# Altium schematic sheet Middle_Main.SchDoc
size A4
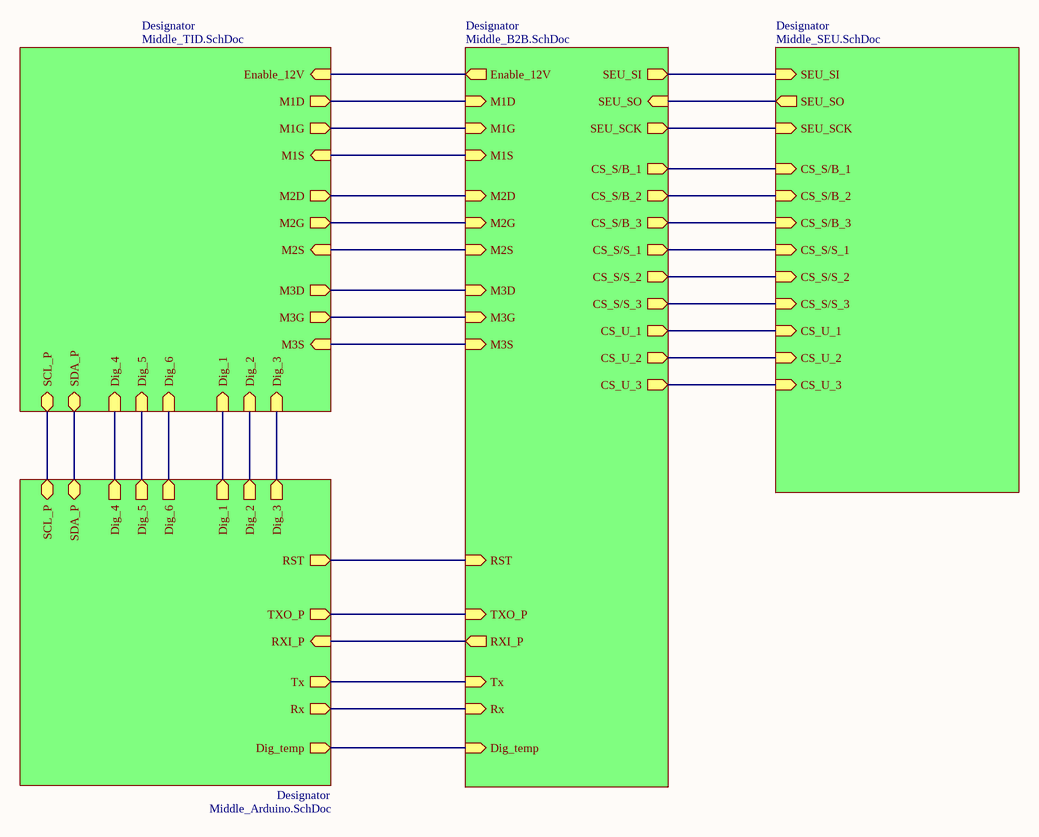
[diagram p0: Middle_Main.SchDoc]

## Sub-sheets
Designator = Middle_TID.SchDoc: M1D (out), M1G (out), M1S (in), M2D (out), M2G (out), M2S (in), M3D (out), M3G (out), M3S (in), Dig_1 (in), Dig_2 (in), Dig_3 (in), SCL_P (bidir), SDA_P (bidir), Enable_12V (in), Dig_4 (in), Dig_5 (in), Dig_6 (in)
Designator = Middle_SEU.SchDoc: SEU_SI (in), SEU_SO (out), SEU_SCK (in), CS_S/B_2 (in), CS_S/B_3 (in), CS_S/S_1 (in), CS_S/S_2 (in), CS_S/S_3 (in), CS_U_1 (in), CS_U_2 (in), CS_S/B_1 (in), CS_U_3 (in)
Designator = Middle_Arduino.SchDoc: SCL_P (bidir), SDA_P (bidir), Dig_1 (out), Dig_2 (out), Dig_3 (out), TXO_P (out), RXI_P (in), Dig_5 (out), Dig_6 (out), Dig_4 (out), RST (out), Tx (out), Rx (out), Dig_temp (out)
Designator = Middle_B2B.SchDoc: M1D (in), M1G (in), M1S (in), M2D (in), M2G (in), M2S (in), M3D (in), M3G (in), M3S (in), SEU_SI (out), SEU_SO (in), SEU_SCK (out), CS_S/B_2 (out), CS_S/B_3 (out), CS_S/S_1 (out), CS_S/S_2 (out), CS_S/S_3 (out), CS_U_1 (out), CS_U_2 (out), CS_S/B_1 (out), CS_U_3 (out), TXO_P (in), RXI_P (out), Enable_12V (out), RST (in), Tx (in), Rx (in), Dig_temp (in)

## Nets
(unnamed): sheet Designator/M1D, sheet Designator/M1D
(unnamed): sheet Designator/M1G, sheet Designator/M1G
(unnamed): sheet Designator/M1S, sheet Designator/M1S
(unnamed): sheet Designator/M2D, sheet Designator/M2D
(unnamed): sheet Designator/M2G, sheet Designator/M2G
(unnamed): sheet Designator/M2S, sheet Designator/M2S
(unnamed): sheet Designator/M3D, sheet Designator/M3D
(unnamed): sheet Designator/M3G, sheet Designator/M3G
(unnamed): sheet Designator/M3S, sheet Designator/M3S
(unnamed): sheet Designator/Dig_1, sheet Designator/Dig_1
(unnamed): sheet Designator/Dig_2, sheet Designator/Dig_2
(unnamed): sheet Designator/Dig_3, sheet Designator/Dig_3
(unnamed): sheet Designator/SCL_P, sheet Designator/SCL_P
(unnamed): sheet Designator/SDA_P, sheet Designator/SDA_P
(unnamed): sheet Designator/Enable_12V, sheet Designator/Enable_12V
(unnamed): sheet Designator/Dig_4, sheet Designator/Dig_4
(unnamed): sheet Designator/Dig_5, sheet Designator/Dig_5
(unnamed): sheet Designator/Dig_6, sheet Designator/Dig_6
(unnamed): sheet Designator/SEU_SI, sheet Designator/SEU_SI
(unnamed): sheet Designator/SEU_SO, sheet Designator/SEU_SO
(unnamed): sheet Designator/SEU_SCK, sheet Designator/SEU_SCK
(unnamed): sheet Designator/CS_S/B_2, sheet Designator/CS_S/B_2
(unnamed): sheet Designator/CS_S/B_3, sheet Designator/CS_S/B_3
(unnamed): sheet Designator/CS_S/S_1, sheet Designator/CS_S/S_1
(unnamed): sheet Designator/CS_S/S_2, sheet Designator/CS_S/S_2
(unnamed): sheet Designator/CS_S/S_3, sheet Designator/CS_S/S_3
(unnamed): sheet Designator/CS_U_1, sheet Designator/CS_U_1
(unnamed): sheet Designator/CS_U_2, sheet Designator/CS_U_2
(unnamed): sheet Designator/CS_S/B_1, sheet Designator/CS_S/B_1
(unnamed): sheet Designator/CS_U_3, sheet Designator/CS_U_3
(unnamed): sheet Designator/TXO_P, sheet Designator/TXO_P
(unnamed): sheet Designator/RXI_P, sheet Designator/RXI_P
(unnamed): sheet Designator/RST, sheet Designator/RST
(unnamed): sheet Designator/Tx, sheet Designator/Tx
(unnamed): sheet Designator/Rx, sheet Designator/Rx
(unnamed): sheet Designator/Dig_temp, sheet Designator/Dig_temp